# Altium schematic sheet LCD.SchDoc
size A; SheetNumber: 10; SheetTotal: 10
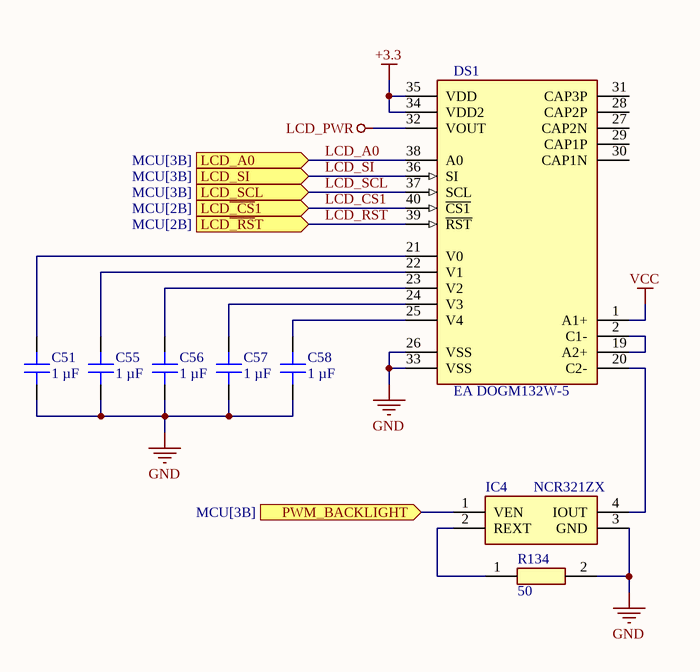
[diagram p0: LCD.SchDoc]

## Parts
C51  1 µF  [CAP 1206_3216 - 0.8MM]
C55  1 µF  [CAP 1206_3216 - 0.8MM]
C56  1 µF  [CAP 1206_3216 - 0.8MM]
C57  1 µF  [CAP 1206_3216 - 0.8MM]
C58  1 µF  [CAP 1206_3216 - 0.8MM]
DS1  EA DOGM132W-5  [FP-EA_DOGM132L-5-MFG]
IC4  NCR321ZX  [SOT230P700X180-4N]
R134  50  [RESC6332X65N]

## Ports
LCD_A0 (in, see MCU[3B]), LCD_SCL (in, see MCU[3B]), LCD_SI (in, see MCU[3B]), LCD~{_CS}1 (in, see MCU[2B]), LCD~{_RS}T (in, see MCU[2B]), PWM_BACKLIGHT (in, see MCU[3B])

## Nets
+3.3: DS1.34(VDD2) DS1.35(VDD)
GND: C51.1 C55.1 C56.1 C57.1 C58.1 DS1.26(VSS) DS1.33(VSS) IC4.3(GND) R134.2
LCD_PWR: DS1.32(VOUT)
VCC: DS1.1(A1+)
LCD~{_CS}1: DS1.40(~{CS1}) ; port LCD~{_CS}1
LCD~{_RS}T: DS1.39(~{RST}) ; port LCD~{_RS}T
LCD_A0: DS1.38(A0) ; port LCD_A0
LCD_SCL: DS1.37(SCL) ; port LCD_SCL
LCD_SI: DS1.36(SI) ; port LCD_SI
PWM_BACKLIGHT: IC4.1(VEN) ; port PWM_BACKLIGHT
NetC51_2: C51.2 DS1.21(V0)
NetC55_2: C55.2 DS1.22(V1)
NetC56_2: C56.2 DS1.23(V2)
NetC57_2: C57.2 DS1.24(V3)
NetC58_2: C58.2 DS1.25(V4)
NetDS1_2: DS1.2(C1-) DS1.19(A2+)
NetDS1_20: DS1.20(C2-) IC4.4(IOUT)
NetIC4_2: IC4.2(REXT) R134.1

Not connected (* = marked no-connect by the designer): DS1 27(CAP2N) 28(CAP2P) 29(CAP1P) 30(CAP1N) 31(CAP3P)

## Library data of the parts
C51 C55-C58 = 885012208093: CAP CER 1UF 50V X7R 1206; manufacturer: Würth Elektronik; Tolerance: ±10%; Part Number: 885012208093; Capacitance: 1 µF; Applications: General Purpose; componentlink1description: Datasheet; componentlink1url: https://katalog.we-online.de/pbs/datasheet/885012208093.pdf; componentlink2description: DigiKey Link; componentlink2url: https://www.digikey.com/en/products/detail/würth-elektronik/885012208093/5453432; Device Package: 1206 (3216 Metric); lastupdated: 6/4/2024 19:10:33; Lifecycle Status: Active; Minimum Order: 1; Mounting Type: Surface Mount, MLCC; Operating Temperature: -55°C ~ 125°C; Package / Case: 1206 (3216 Metric); packaging: TapeAndReel; partid: 39665; Part Status: Active; price: 0.10; series: WCAP-CSGP; Size / Dimension: 0.126" L x 0.063" W (3.20mm x 1.60mm); Supplier 1: DigiKey; Supplier Part Number 1: 732-7577-1-ND; Temperature Coefficient: X7R; Thickness (Max): 0.075" (1.90mm); value: 1 µF; Voltage - Rated: 50V
DS1 = CMP-137185-000001-1: LCD MOD GRAPH 132X32 Y/G; Supply Current: 140uA; Background Color: Green; Resolution (height): 32pixel; Fluid Type: STN POSITIVE; Interface: SPI; Viewing Area (width): 51mm; Resolution (width): 132pixel; Viewing Area (height): 15mm; RoHS Compliant: No; Height: 27.94mm; Min Operating Temperature: -20°C; Packaging: Bulk; Max Operating Temperature: 70°C; Nominal Supply Current: 140uA; Series: EA DOGM; Width: 55mm
IC4 = NCR321ZX: Integrated Circuit; Manufacturer_Name: Nexperia; Datasheet Link: https://componentsearchengine.com/Datasheets/2/NCR321ZX.pdf; Height: 1.8mm; Manufacturer_Part_Number: NCR321ZX; Mouser Part Number: 771-NCR321ZX; Mouser Price/Stock: https://www.mouser.co.uk/ProductDetail/Nexperia/NCR321ZX?qs=ahcBuItHZ3zTr8W8PrL%2FCg%3D%3D; Arrow Part Number: NCR321ZX; Arrow Price/Stock: https://www.arrow.com/en/products/ncr321zx/nexperia?region=nac
R134 = RNCL2512FT50R0: Resistor; Manufacturer_Name: Stackpole Electronics; Datasheet Link: https://www.seielect.com/catalog/sei-rncl.pdf; Height: 0.65mm; Manufacturer_Part_Number: RNCL2512FT50R0; Resistance: 50